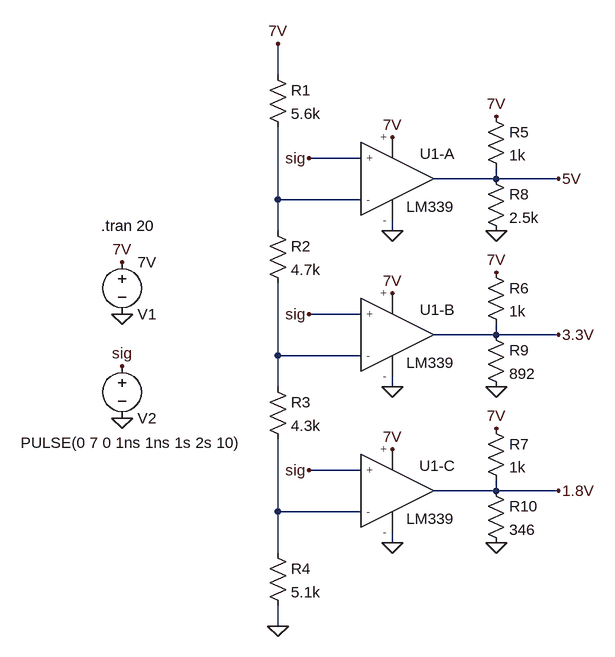
[diagram p0: schematic comparator_circuit.asc]
comparator_circuit.asc, the LTspice schematic file:
Version 4
SHEET 1 880 1012
WIRE -160 -64 -160 -112
WIRE -32 64 -112 64
WIRE 176 96 176 80
WIRE 176 96 80 96
WIRE 272 96 176 96
WIRE -160 128 -160 16
WIRE -32 128 -160 128
WIRE -160 176 -160 128
WIRE 16 176 16 160
WIRE -32 304 -112 304
WIRE 176 336 176 320
WIRE 176 336 80 336
WIRE 272 336 176 336
WIRE -160 368 -160 256
WIRE -32 368 -160 368
WIRE -160 416 -160 368
WIRE 16 416 16 400
WIRE -32 544 -112 544
WIRE 176 576 176 560
WIRE 176 576 80 576
WIRE 272 576 176 576
WIRE -160 608 -160 496
WIRE -32 608 -160 608
WIRE 16 656 16 640
WIRE -160 672 -160 608
WIRE -160 784 -160 752
FLAG -400 304 0
FLAG -400 224 7V
FLAG 16 32 7V
FLAG -160 -112 7V
FLAG -160 784 0
FLAG 16 176 0
FLAG -400 464 0
FLAG 272 96 5V
FLAG -400 384 sig
FLAG 16 272 7V
FLAG 16 416 0
FLAG 16 512 7V
FLAG 16 656 0
FLAG -112 64 sig
FLAG -112 304 sig
FLAG -112 544 sig
FLAG 272 336 3.3V
FLAG 272 576 1.8V
FLAG 176 0 7V
FLAG 176 240 7V
FLAG 176 480 7V
FLAG 176 176 0
FLAG 176 416 0
FLAG 176 656 0
SYMBOL AutoGenerated\\LM339 0 96 R0
SYMATTR InstName U1-A
SYMBOL voltage -400 208 R0
WINDOW 0 24 96 Left 2
WINDOW 3 24 16 Left 2
WINDOW 123 0 0 Left 0
WINDOW 39 0 0 Left 0
SYMATTR InstName V1
SYMATTR Value 7V
SYMBOL res -176 -80 R0
SYMATTR InstName R1
SYMATTR Value 5.6k
SYMBOL res -176 160 R0
SYMATTR InstName R2
SYMATTR Value 4.7k
SYMBOL voltage -400 368 R0
WINDOW 0 24 96 Left 2
WINDOW 3 -156 134 Left 2
WINDOW 123 0 0 Left 0
WINDOW 39 0 0 Left 0
SYMATTR InstName V2
SYMATTR Value PULSE(0 7 0 1ns 1ns 1s 2s 10)
SYMBOL AutoGenerated\\LM339 0 336 R0
SYMATTR InstName U1-B
SYMBOL AutoGenerated\\LM339 0 576 R0
SYMATTR InstName U1-C
SYMBOL res -176 400 R0
SYMATTR InstName R3
SYMATTR Value 4.3k
SYMBOL res -176 656 R0
SYMATTR InstName R4
SYMATTR Value 5.1k
SYMBOL res 160 -16 R0
SYMATTR InstName R5
SYMATTR Value 1k
SYMBOL res 160 224 R0
SYMATTR InstName R6
SYMATTR Value 1k
SYMBOL res 160 464 R0
SYMATTR InstName R7
SYMATTR Value 1k
SYMBOL res 160 80 R0
SYMATTR InstName R8
SYMATTR Value 2.5k
SYMBOL res 160 320 R0
SYMATTR InstName R9
SYMATTR Value 892
SYMBOL res 160 560 R0
SYMATTR InstName R10
SYMATTR Value 346
TEXT -432 168 Left 2 !.tran 20

The netlist it stands for:
* comparator_circuit.asc
XU1-A sig N001 7V 0 5V LM339  ; pins + - + - ?
V1 7V 0 7V
R1 7V N001 5.6k
R2 N001 N002 4.7k
V2 sig 0 PULSE(0 7 0 1ns 1ns 1s 2s 10)
XU1-B sig N002 7V 0 3.3V LM339  ; pins + - + - ?
XU1-C sig N003 7V 0 1.8V LM339  ; pins + - + - ?
R3 N002 N003 4.3k
R4 N003 0 5.1k
R5 7V 5V 1k
R6 7V 3.3V 1k
R7 7V 1.8V 1k
R8 5V 0 2.5k
R9 3.3V 0 892
R10 1.8V 0 346
.tran 20
.lib C:\Users\walto\Desktop\School\2021-Spring\COMPE-496A\senior_design\mini_project\LM339.5_1
.backanno
.end